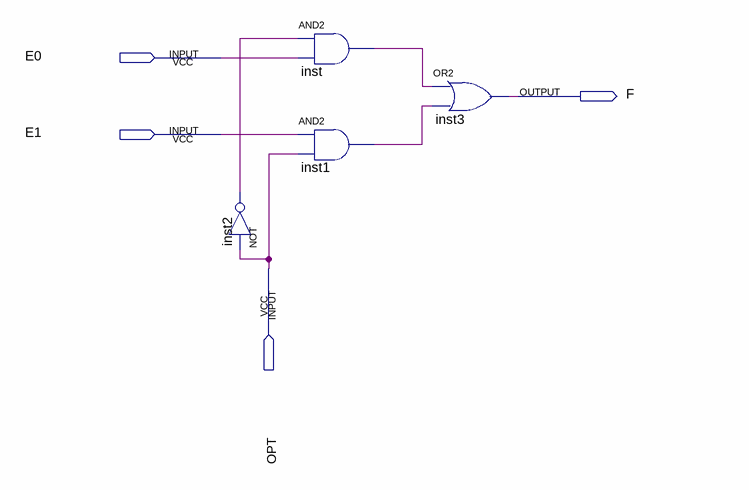
[diagram p0: schematic sheet]
// Quartus schematic mux2.bdf as structural Verilog: 4 symbols, 4 pins
module mux2 (
  input  E0,
  input  E1,
  input  OPT,
  output F
);

  wire inst1_out, inst2_out, inst_out;

  not inst2 (inst2_out, OPT);
  and inst (inst_out, inst2_out, E0);
  and inst1 (inst1_out, E1, OPT);
  or inst3 (F, inst_out, inst1_out);
endmodule
